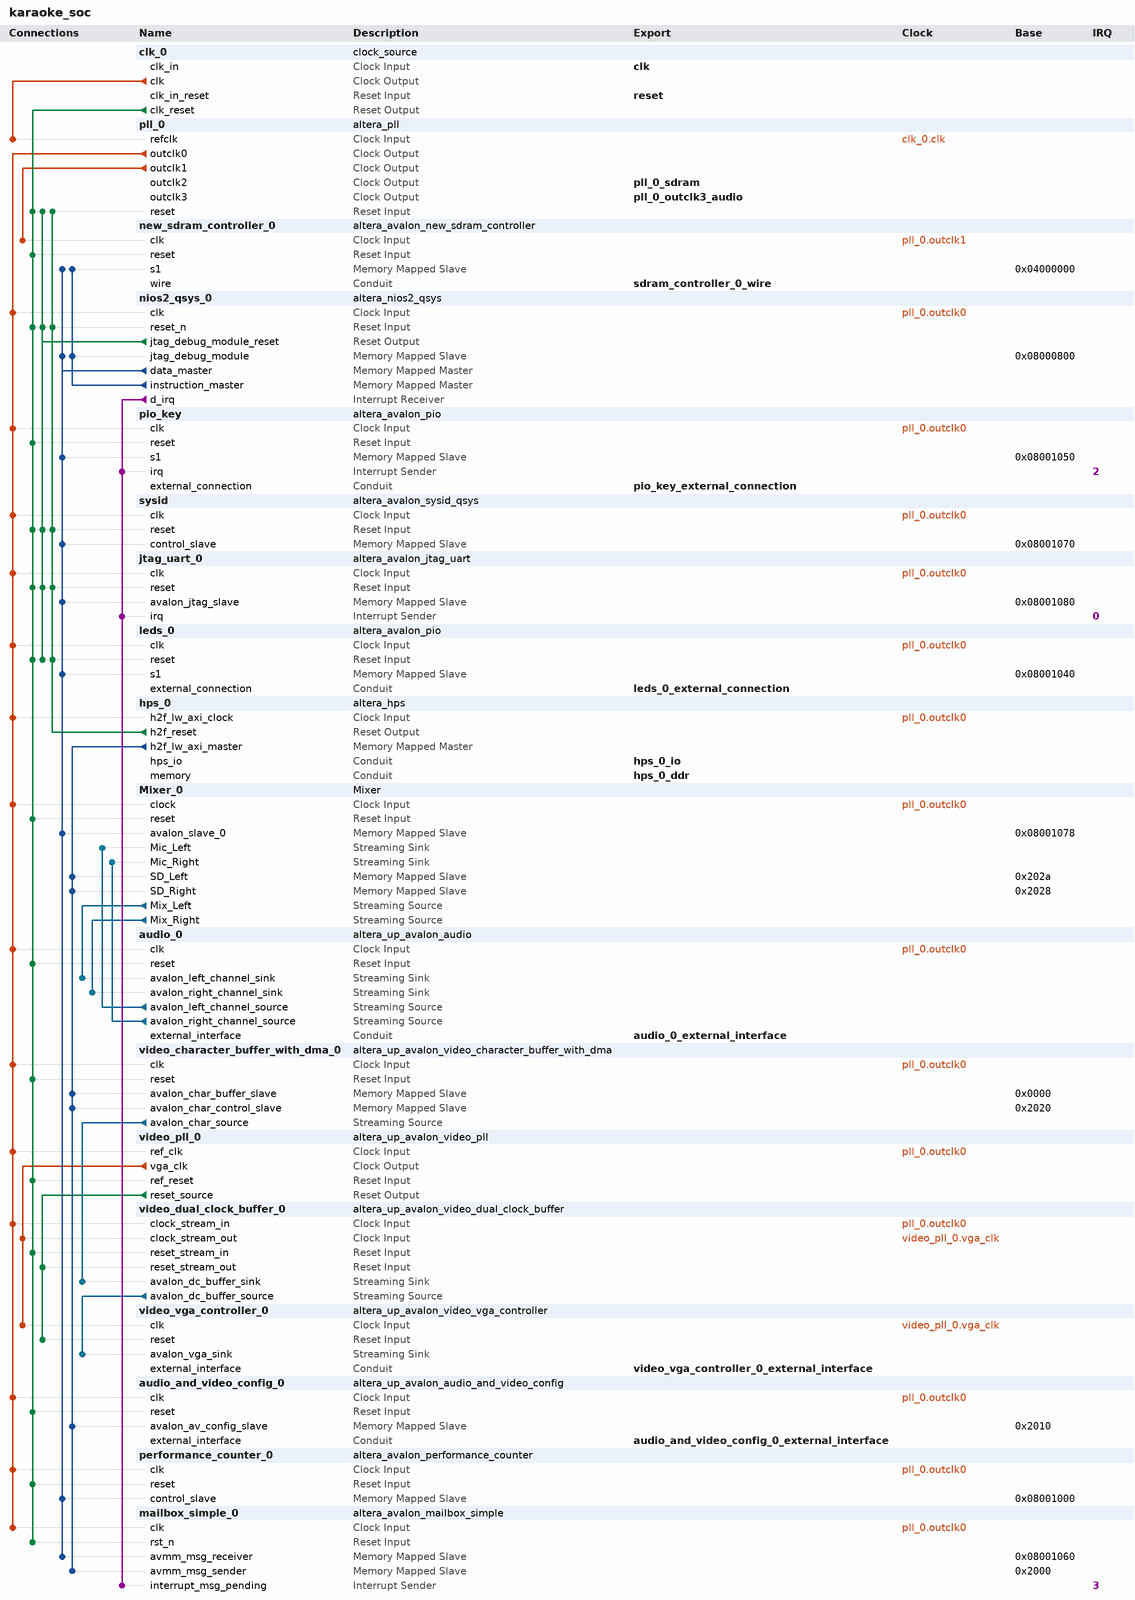
[diagram p0: system contents]
# Platform Designer (Qsys) system karaoke_soc, Cyclone V 5CSEMA5F31C6
# Parameters at their usual value, and those the tool derives, are not listed.
package require -exact qsys 15.1
create_system karaoke_soc
set_project_property DEVICE_FAMILY {Cyclone V}
set_project_property DEVICE 5CSEMA5F31C6

add_instance clk_0 clock_source 15.1
set_instance_parameter_value clk_0 clockFrequency 50000000

add_instance pll_0 altera_pll 15.1
set_instance_parameter_value pll_0 gui_device_speed_grade 1
set_instance_parameter_value pll_0 gui_number_of_clocks 4
set_instance_parameter_value pll_0 gui_operation_mode normal
set_instance_parameter_value pll_0 gui_output_clock_frequency0 50.0
set_instance_parameter_value pll_0 gui_output_clock_frequency1 100.0
set_instance_parameter_value pll_0 gui_output_clock_frequency2 100.0
set_instance_parameter_value pll_0 gui_output_clock_frequency3 12.288
set_instance_parameter_value pll_0 gui_phase_shift2 -3758
set_instance_parameter_value pll_0 gui_pll_mode {Integer-N PLL}
set_instance_parameter_value pll_0 gui_reference_clock_frequency 50.0
set_instance_parameter_value pll_0 gui_use_locked false

add_instance new_sdram_controller_0 altera_avalon_new_sdram_controller 15.1
set_instance_parameter_value new_sdram_controller_0 TAC 5.4
set_instance_parameter_value new_sdram_controller_0 TRCD 15.0
set_instance_parameter_value new_sdram_controller_0 TRP 15.0
set_instance_parameter_value new_sdram_controller_0 casLatency 3
set_instance_parameter_value new_sdram_controller_0 columnWidth 10
set_instance_parameter_value new_sdram_controller_0 dataWidth 16
set_instance_parameter_value new_sdram_controller_0 generateSimulationModel false
set_instance_parameter_value new_sdram_controller_0 model single_Micron_MT48LC4M32B2_7_chip
set_instance_parameter_value new_sdram_controller_0 numberOfBanks 4
set_instance_parameter_value new_sdram_controller_0 numberOfChipSelects 1
set_instance_parameter_value new_sdram_controller_0 powerUpDelay 100.0
set_instance_parameter_value new_sdram_controller_0 refreshPeriod 7.8125
set_instance_parameter_value new_sdram_controller_0 rowWidth 13

add_instance nios2_qsys_0 altera_nios2_qsys 15.1
set_instance_parameter_value nios2_qsys_0 breakSlave nios2_qsys_0.jtag_debug_module
set_instance_parameter_value nios2_qsys_0 exceptionSlave new_sdram_controller_0.s1
set_instance_parameter_value nios2_qsys_0 icache_size 4096
set_instance_parameter_value nios2_qsys_0 impl Fast
set_instance_parameter_value nios2_qsys_0 mmu_TLBMissExcSlave None
set_instance_parameter_value nios2_qsys_0 resetSlave new_sdram_controller_0.s1
set_instance_parameter_value nios2_qsys_0 resetrequest_enabled true

add_instance pio_key altera_avalon_pio 15.1
set_instance_parameter_value pio_key captureEdge true
set_instance_parameter_value pio_key direction Input
set_instance_parameter_value pio_key edgeType FALLING
set_instance_parameter_value pio_key generateIRQ true
set_instance_parameter_value pio_key irqType EDGE
set_instance_parameter_value pio_key width 4

add_instance sysid altera_avalon_sysid_qsys 15.1
set_instance_parameter_value sysid id 1

add_instance jtag_uart_0 altera_avalon_jtag_uart 15.1
set_instance_parameter_value jtag_uart_0 simInteractiveOptions NO_INTERACTIVE_WINDOWS

add_instance leds_0 altera_avalon_pio 15.1
set_instance_parameter_value leds_0 direction Output
set_instance_parameter_value leds_0 width 10

add_instance hps_0 altera_hps 15.1
set_instance_parameter_value hps_0 EMAC1_Mode RGMII
set_instance_parameter_value hps_0 EMAC1_PinMuxing {HPS I/O Set 0}
set_instance_parameter_value hps_0 F2SCLK_COLDRST_Enable false
set_instance_parameter_value hps_0 F2SCLK_DBGRST_Enable false
set_instance_parameter_value hps_0 F2SCLK_WARMRST_Enable false
set_instance_parameter_value hps_0 F2SINTERRUPT_Enable false
set_instance_parameter_value hps_0 F2S_Width 0
set_instance_parameter_value hps_0 FPGA_PERIPHERAL_OUTPUT_CLOCK_FREQ_EMAC0_GTX_CLK 125
set_instance_parameter_value hps_0 FPGA_PERIPHERAL_OUTPUT_CLOCK_FREQ_EMAC0_MD_CLK 2.5
set_instance_parameter_value hps_0 FPGA_PERIPHERAL_OUTPUT_CLOCK_FREQ_EMAC1_GTX_CLK 125
set_instance_parameter_value hps_0 FPGA_PERIPHERAL_OUTPUT_CLOCK_FREQ_EMAC1_MD_CLK 2.5
set_instance_parameter_value hps_0 HPS_PROTOCOL DDR3
set_instance_parameter_value hps_0 I2C0_Mode N/A
set_instance_parameter_value hps_0 I2C0_PinMuxing Unused
set_instance_parameter_value hps_0 I2C1_Mode N/A
set_instance_parameter_value hps_0 I2C1_PinMuxing Unused
set_instance_parameter_value hps_0 LWH2F_Enable true
set_instance_parameter_value hps_0 MEM_BANKADDR_WIDTH 3
set_instance_parameter_value hps_0 MEM_CLK_FREQ 400.0
set_instance_parameter_value hps_0 MEM_COL_ADDR_WIDTH 10
set_instance_parameter_value hps_0 MEM_DQ_WIDTH 32
set_instance_parameter_value hps_0 MEM_DRV_STR RZQ/7
set_instance_parameter_value hps_0 MEM_ROW_ADDR_WIDTH 15
set_instance_parameter_value hps_0 MEM_RTT_NOM RZQ/4
set_instance_parameter_value hps_0 MEM_RTT_WR RZQ/4
set_instance_parameter_value hps_0 MEM_TCL 11
set_instance_parameter_value hps_0 MEM_TFAW_NS 30.0
set_instance_parameter_value hps_0 MEM_TRAS_NS 35.0
set_instance_parameter_value hps_0 MEM_TRCD_NS 13.75
set_instance_parameter_value hps_0 MEM_TRFC_NS 260.0
set_instance_parameter_value hps_0 MEM_TRP_NS 13.75
set_instance_parameter_value hps_0 MEM_VENDOR Other
set_instance_parameter_value hps_0 MEM_WTCL 8
set_instance_parameter_value hps_0 QSPI_Mode N/A
set_instance_parameter_value hps_0 QSPI_PinMuxing Unused
set_instance_parameter_value hps_0 REF_CLK_FREQ 25.0
set_instance_parameter_value hps_0 S2FCLK_USER2CLK 1
set_instance_parameter_value hps_0 S2F_Width 0
set_instance_parameter_value hps_0 SDIO_Mode {4-bit Data}
set_instance_parameter_value hps_0 SDIO_PinMuxing {HPS I/O Set 0}
set_instance_parameter_value hps_0 SPIM1_Mode N/A
set_instance_parameter_value hps_0 SPIM1_PinMuxing Unused
set_instance_parameter_value hps_0 STM_Enable false
set_instance_parameter_value hps_0 TIMING_BOARD_AC_SKEW 0.02
set_instance_parameter_value hps_0 TIMING_BOARD_AC_TO_CK_SKEW 0.01
set_instance_parameter_value hps_0 TIMING_BOARD_DQ_TO_DQS_SKEW 0.05
set_instance_parameter_value hps_0 TIMING_BOARD_MAX_CK_DELAY 0.03
set_instance_parameter_value hps_0 TIMING_BOARD_MAX_DQS_DELAY 0.02
set_instance_parameter_value hps_0 TIMING_BOARD_SKEW_BETWEEN_DQS 0.06
set_instance_parameter_value hps_0 TIMING_BOARD_SKEW_CKDQS_DIMM_MAX 0.12
set_instance_parameter_value hps_0 TIMING_BOARD_SKEW_CKDQS_DIMM_MIN 0.06
set_instance_parameter_value hps_0 TIMING_BOARD_SKEW_WITHIN_DQS 0.01
set_instance_parameter_value hps_0 TIMING_TDH 65
set_instance_parameter_value hps_0 TIMING_TDQSCK 255
set_instance_parameter_value hps_0 TIMING_TDQSQ 125
set_instance_parameter_value hps_0 TIMING_TDS 30
set_instance_parameter_value hps_0 TIMING_TIH 140
set_instance_parameter_value hps_0 TIMING_TIS 180
set_instance_parameter_value hps_0 TIMING_TQSH 0.4
set_instance_parameter_value hps_0 UART0_Mode {No Flow Control}
set_instance_parameter_value hps_0 UART0_PinMuxing {HPS I/O Set 0}
set_instance_parameter_value hps_0 USB1_Mode N/A
set_instance_parameter_value hps_0 USB1_PinMuxing Unused
set_instance_parameter_value hps_0 desired_cfg_clk_mhz 100.0
set_instance_parameter_value hps_0 desired_qspi_clk_mhz 400.0

add_instance Mixer_0 Mixer 1.0
set_instance_parameter_value Mixer_0 DATA_WIDTH 16

add_instance audio_0 altera_up_avalon_audio 15.1
set_instance_parameter_value audio_0 audio_in true
set_instance_parameter_value audio_0 avalon_bus_type Streaming
set_instance_parameter_value audio_0 dw 16

add_instance video_character_buffer_with_dma_0 altera_up_avalon_video_character_buffer_with_dma 15.1
set_instance_parameter_value video_character_buffer_with_dma_0 enable_transparency false

add_instance video_pll_0 altera_up_avalon_video_pll 15.1
set_instance_parameter_value video_pll_0 camera {5MP Digital Camera}
set_instance_parameter_value video_pll_0 gui_refclk 50.0
set_instance_parameter_value video_pll_0 lcd {7" LCD on VEEK-MT and MTL Module}

add_instance video_dual_clock_buffer_0 altera_up_avalon_video_dual_clock_buffer 15.1
set_instance_parameter_value video_dual_clock_buffer_0 color_bits 10

add_instance video_vga_controller_0 altera_up_avalon_video_vga_controller 15.1
set_instance_parameter_value video_vga_controller_0 board DE1-SoC
set_instance_parameter_value video_vga_controller_0 resolution {VGA 640x480}

add_instance audio_and_video_config_0 altera_up_avalon_audio_and_video_config 15.1
set_instance_parameter_value audio_and_video_config_0 audio_in {Microphone to ADC}
set_instance_parameter_value audio_and_video_config_0 bit_length 16
set_instance_parameter_value audio_and_video_config_0 board DE1-SoC
set_instance_parameter_value audio_and_video_config_0 line_in_bypass false
set_instance_parameter_value audio_and_video_config_0 sampling_rate {48 kHz}

add_instance performance_counter_0 altera_avalon_performance_counter 15.1
set_instance_parameter_value performance_counter_0 numberOfSections 3

add_instance mailbox_simple_0 altera_avalon_mailbox_simple 15.1
set_instance_parameter_value mailbox_simple_0 AWIDTH 2
set_instance_parameter_value mailbox_simple_0 DWIDTH 32
set_instance_parameter_value mailbox_simple_0 MSG_ARRIVAL_NOTIFY 1
set_instance_parameter_value mailbox_simple_0 MSG_SPACE_NOTIFY 0

# connections
add_connection clk_0.clk pll_0.refclk clock
add_connection pll_0.outclk0 audio_0.clk clock
add_connection pll_0.outclk0 audio_and_video_config_0.clk clock
add_connection pll_0.outclk0 hps_0.h2f_lw_axi_clock clock
add_connection pll_0.outclk0 jtag_uart_0.clk clock
add_connection pll_0.outclk0 leds_0.clk clock
add_connection pll_0.outclk0 mailbox_simple_0.clk clock
add_connection pll_0.outclk0 Mixer_0.clock clock
add_connection pll_0.outclk0 nios2_qsys_0.clk clock
add_connection pll_0.outclk0 performance_counter_0.clk clock
add_connection pll_0.outclk0 pio_key.clk clock
add_connection pll_0.outclk0 sysid.clk clock
add_connection pll_0.outclk0 video_character_buffer_with_dma_0.clk clock
add_connection pll_0.outclk0 video_dual_clock_buffer_0.clock_stream_in clock
add_connection pll_0.outclk0 video_pll_0.ref_clk clock
add_connection pll_0.outclk1 new_sdram_controller_0.clk clock
add_connection video_pll_0.vga_clk video_dual_clock_buffer_0.clock_stream_out clock
add_connection video_pll_0.vga_clk video_vga_controller_0.clk clock
add_connection clk_0.clk_reset audio_0.reset reset
add_connection clk_0.clk_reset audio_and_video_config_0.reset reset
add_connection clk_0.clk_reset jtag_uart_0.reset reset
add_connection clk_0.clk_reset leds_0.reset reset
add_connection clk_0.clk_reset mailbox_simple_0.rst_n reset
add_connection clk_0.clk_reset Mixer_0.reset reset
add_connection clk_0.clk_reset new_sdram_controller_0.reset reset
add_connection clk_0.clk_reset nios2_qsys_0.reset_n reset
add_connection clk_0.clk_reset performance_counter_0.reset reset
add_connection clk_0.clk_reset pio_key.reset reset
add_connection clk_0.clk_reset pll_0.reset reset
add_connection clk_0.clk_reset sysid.reset reset
add_connection clk_0.clk_reset video_character_buffer_with_dma_0.reset reset
add_connection clk_0.clk_reset video_dual_clock_buffer_0.reset_stream_in reset
add_connection clk_0.clk_reset video_pll_0.ref_reset reset
add_connection hps_0.h2f_reset jtag_uart_0.reset reset
add_connection hps_0.h2f_reset leds_0.reset reset
add_connection hps_0.h2f_reset nios2_qsys_0.reset_n reset
add_connection hps_0.h2f_reset pll_0.reset reset
add_connection hps_0.h2f_reset sysid.reset reset
add_connection nios2_qsys_0.jtag_debug_module_reset jtag_uart_0.reset reset
add_connection nios2_qsys_0.jtag_debug_module_reset leds_0.reset reset
add_connection nios2_qsys_0.jtag_debug_module_reset nios2_qsys_0.reset_n reset
add_connection nios2_qsys_0.jtag_debug_module_reset pll_0.reset reset
add_connection nios2_qsys_0.jtag_debug_module_reset sysid.reset reset
add_connection video_pll_0.reset_source video_dual_clock_buffer_0.reset_stream_out reset
add_connection video_pll_0.reset_source video_vga_controller_0.reset reset
add_connection hps_0.h2f_lw_axi_master audio_and_video_config_0.avalon_av_config_slave avalon
set_connection_parameter_value hps_0.h2f_lw_axi_master/audio_and_video_config_0.avalon_av_config_slave baseAddress 0x2010
add_connection hps_0.h2f_lw_axi_master mailbox_simple_0.avmm_msg_sender avalon
set_connection_parameter_value hps_0.h2f_lw_axi_master/mailbox_simple_0.avmm_msg_sender baseAddress 0x2000
add_connection hps_0.h2f_lw_axi_master Mixer_0.SD_Left avalon
set_connection_parameter_value hps_0.h2f_lw_axi_master/Mixer_0.SD_Left baseAddress 0x202a
add_connection hps_0.h2f_lw_axi_master Mixer_0.SD_Right avalon
set_connection_parameter_value hps_0.h2f_lw_axi_master/Mixer_0.SD_Right baseAddress 0x2028
add_connection hps_0.h2f_lw_axi_master video_character_buffer_with_dma_0.avalon_char_buffer_slave avalon
set_connection_parameter_value hps_0.h2f_lw_axi_master/video_character_buffer_with_dma_0.avalon_char_buffer_slave baseAddress 0x0000
add_connection hps_0.h2f_lw_axi_master video_character_buffer_with_dma_0.avalon_char_control_slave avalon
set_connection_parameter_value hps_0.h2f_lw_axi_master/video_character_buffer_with_dma_0.avalon_char_control_slave baseAddress 0x2020
add_connection nios2_qsys_0.data_master jtag_uart_0.avalon_jtag_slave avalon
set_connection_parameter_value nios2_qsys_0.data_master/jtag_uart_0.avalon_jtag_slave baseAddress 0x08001080
add_connection nios2_qsys_0.data_master leds_0.s1 avalon
set_connection_parameter_value nios2_qsys_0.data_master/leds_0.s1 baseAddress 0x08001040
add_connection nios2_qsys_0.data_master mailbox_simple_0.avmm_msg_receiver avalon
set_connection_parameter_value nios2_qsys_0.data_master/mailbox_simple_0.avmm_msg_receiver baseAddress 0x08001060
add_connection nios2_qsys_0.data_master Mixer_0.avalon_slave_0 avalon
set_connection_parameter_value nios2_qsys_0.data_master/Mixer_0.avalon_slave_0 baseAddress 0x08001078
add_connection nios2_qsys_0.data_master new_sdram_controller_0.s1 avalon
set_connection_parameter_value nios2_qsys_0.data_master/new_sdram_controller_0.s1 baseAddress 0x04000000
add_connection nios2_qsys_0.data_master nios2_qsys_0.jtag_debug_module avalon
set_connection_parameter_value nios2_qsys_0.data_master/nios2_qsys_0.jtag_debug_module baseAddress 0x08000800
add_connection nios2_qsys_0.data_master performance_counter_0.control_slave avalon
set_connection_parameter_value nios2_qsys_0.data_master/performance_counter_0.control_slave baseAddress 0x08001000
add_connection nios2_qsys_0.data_master pio_key.s1 avalon
set_connection_parameter_value nios2_qsys_0.data_master/pio_key.s1 baseAddress 0x08001050
add_connection nios2_qsys_0.data_master sysid.control_slave avalon
set_connection_parameter_value nios2_qsys_0.data_master/sysid.control_slave baseAddress 0x08001070
add_connection nios2_qsys_0.instruction_master new_sdram_controller_0.s1 avalon
set_connection_parameter_value nios2_qsys_0.instruction_master/new_sdram_controller_0.s1 baseAddress 0x04000000
add_connection nios2_qsys_0.instruction_master nios2_qsys_0.jtag_debug_module avalon
set_connection_parameter_value nios2_qsys_0.instruction_master/nios2_qsys_0.jtag_debug_module baseAddress 0x08000800
add_connection audio_0.avalon_left_channel_source Mixer_0.Mic_Left avalon_streaming
add_connection audio_0.avalon_right_channel_source Mixer_0.Mic_Right avalon_streaming
add_connection Mixer_0.Mix_Left audio_0.avalon_left_channel_sink avalon_streaming
add_connection Mixer_0.Mix_Right audio_0.avalon_right_channel_sink avalon_streaming
add_connection video_character_buffer_with_dma_0.avalon_char_source video_dual_clock_buffer_0.avalon_dc_buffer_sink avalon_streaming
add_connection video_dual_clock_buffer_0.avalon_dc_buffer_source video_vga_controller_0.avalon_vga_sink avalon_streaming
add_connection nios2_qsys_0.d_irq jtag_uart_0.irq interrupt
set_connection_parameter_value nios2_qsys_0.d_irq/jtag_uart_0.irq irqNumber 0
add_connection nios2_qsys_0.d_irq mailbox_simple_0.interrupt_msg_pending interrupt
set_connection_parameter_value nios2_qsys_0.d_irq/mailbox_simple_0.interrupt_msg_pending irqNumber 3
add_connection nios2_qsys_0.d_irq pio_key.irq interrupt
set_connection_parameter_value nios2_qsys_0.d_irq/pio_key.irq irqNumber 2

# exported interfaces
add_interface audio_0_external_interface conduit end
set_interface_property audio_0_external_interface EXPORT_OF audio_0.external_interface
add_interface audio_and_video_config_0_external_interface conduit end
set_interface_property audio_and_video_config_0_external_interface EXPORT_OF audio_and_video_config_0.external_interface
add_interface clk clock sink
set_interface_property clk EXPORT_OF clk_0.clk_in
add_interface hps_0_ddr conduit end
set_interface_property hps_0_ddr EXPORT_OF hps_0.memory
add_interface hps_0_io conduit end
set_interface_property hps_0_io EXPORT_OF hps_0.hps_io
add_interface leds_0_external_connection conduit end
set_interface_property leds_0_external_connection EXPORT_OF leds_0.external_connection
add_interface pio_key_external_connection conduit end
set_interface_property pio_key_external_connection EXPORT_OF pio_key.external_connection
add_interface pll_0_outclk3_audio clock source
set_interface_property pll_0_outclk3_audio EXPORT_OF pll_0.outclk3
add_interface pll_0_sdram clock source
set_interface_property pll_0_sdram EXPORT_OF pll_0.outclk2
add_interface reset reset sink
set_interface_property reset EXPORT_OF clk_0.clk_in_reset
add_interface sdram_controller_0_wire conduit end
set_interface_property sdram_controller_0_wire EXPORT_OF new_sdram_controller_0.wire
add_interface video_vga_controller_0_external_interface conduit end
set_interface_property video_vga_controller_0_external_interface EXPORT_OF video_vga_controller_0.external_interface

set_interconnect_requirement {$system} qsys_mm.clockCrossingAdapter HANDSHAKE
set_interconnect_requirement {$system} qsys_mm.enableEccProtection FALSE
set_interconnect_requirement {$system} qsys_mm.insertDefaultSlave FALSE
set_interconnect_requirement {$system} qsys_mm.maxAdditionalLatency 1

save_system karaoke_soc.qsys
